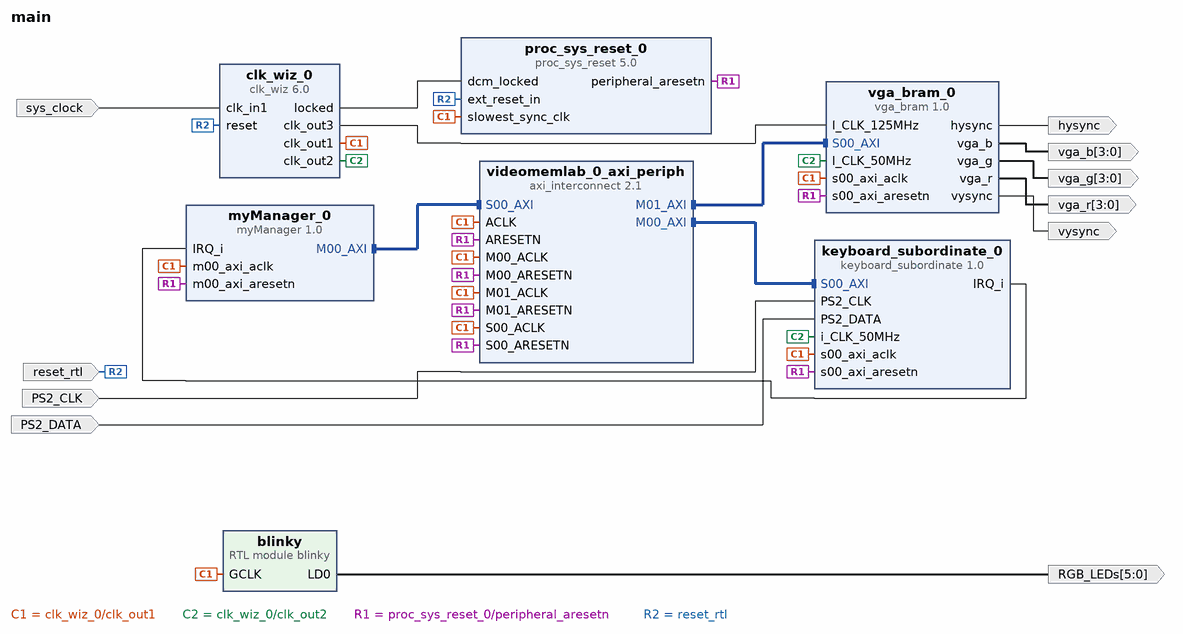
[diagram p0: block diagram of the top level]
# Vivado block design main, xc7z007sclg400-1, Vivado 2022.2
create_bd_design main

create_bd_port -dir I -type rst reset_rtl
set_property -dict {CONFIG.POLARITY ACTIVE_HIGH} [get_bd_ports reset_rtl]
create_bd_port -dir O -from 5 -to 0 RGB_LEDs
create_bd_port -dir I -type clk sys_clock
set_property -dict {CONFIG.FREQ_HZ 125000000 CONFIG.PHASE 0.0} [get_bd_ports sys_clock]
create_bd_port -dir I PS2_CLK
create_bd_port -dir I PS2_DATA
create_bd_port -dir O -from 3 -to 0 vga_b
create_bd_port -dir O -from 3 -to 0 vga_g
create_bd_port -dir O -from 3 -to 0 vga_r
create_bd_port -dir O vysync
create_bd_port -dir O hysync

create_bd_cell -type ip -vlnv xilinx.com:ip:proc_sys_reset:5.0 proc_sys_reset_0
create_bd_cell -type ip -vlnv xilinx.com:ip:clk_wiz:6.0 clk_wiz_0
set_property -dict [list \
  CONFIG.CLKOUT2_JITTER 143.688 \
  CONFIG.CLKOUT2_PHASE_ERROR 96.948 \
  CONFIG.CLKOUT2_REQUESTED_OUT_FREQ 50.000 \
  CONFIG.CLKOUT2_USED true \
  CONFIG.CLKOUT3_JITTER 119.348 \
  CONFIG.CLKOUT3_PHASE_ERROR 96.948 \
  CONFIG.CLKOUT3_REQUESTED_OUT_FREQ 125.000 \
  CONFIG.CLKOUT3_USED true \
  CONFIG.CLK_IN1_BOARD_INTERFACE sys_clock \
  CONFIG.MMCM_CLKOUT1_DIVIDE 20 \
  CONFIG.MMCM_CLKOUT2_DIVIDE 8 \
  CONFIG.NUM_OUT_CLKS 3 \
  CONFIG.USE_BOARD_FLOW true \
] [get_bd_cells clk_wiz_0]
create_bd_cell -type module -reference blinky blinky
set_property -dict {CONFIG.out_off_mask 0x00000021 CONFIG.out_on_mask 0x00000017 CONFIG.out_size 6} [get_bd_cells blinky]
create_bd_cell -type ip -vlnv Sola-Thomas:Project_6:keyboard_subordinate:1.0 keyboard_subordinate_0
create_bd_cell -type ip -vlnv solathomas.com:Project_6:vga_bram:1.0 vga_bram_0
create_bd_cell -type ip -vlnv xilinx.com:ip:axi_interconnect:2.1 videomemlab_0_axi_periph
set_property -dict {CONFIG.NUM_MI 2} [get_bd_cells videomemlab_0_axi_periph]
create_bd_cell -type ip -vlnv solathomas.com:Project_6:myManager:1.0 myManager_0

# ---- connections ----

connect_bd_intf_net [get_bd_intf_pins myManager_0/M00_AXI] [get_bd_intf_pins videomemlab_0_axi_periph/S00_AXI]
connect_bd_intf_net [get_bd_intf_pins videomemlab_0_axi_periph/M00_AXI] [get_bd_intf_pins keyboard_subordinate_0/S00_AXI]
connect_bd_intf_net [get_bd_intf_pins videomemlab_0_axi_periph/M01_AXI] [get_bd_intf_pins vga_bram_0/S00_AXI]
connect_bd_net [get_bd_ports PS2_CLK] [get_bd_pins keyboard_subordinate_0/PS2_CLK]
connect_bd_net [get_bd_ports PS2_DATA] [get_bd_pins keyboard_subordinate_0/PS2_DATA]
connect_bd_net -net blinky_0_LD0 [get_bd_pins blinky/LD0] [get_bd_ports RGB_LEDs]
connect_bd_net [get_bd_pins clk_wiz_0/clk_out1] \
  [get_bd_pins proc_sys_reset_0/slowest_sync_clk] [get_bd_pins blinky/GCLK] [get_bd_pins keyboard_subordinate_0/s00_axi_aclk] \
  [get_bd_pins vga_bram_0/s00_axi_aclk] [get_bd_pins videomemlab_0_axi_periph/ACLK] \
  [get_bd_pins videomemlab_0_axi_periph/S00_ACLK] [get_bd_pins videomemlab_0_axi_periph/M00_ACLK] \
  [get_bd_pins videomemlab_0_axi_periph/M01_ACLK] [get_bd_pins myManager_0/m00_axi_aclk]
connect_bd_net [get_bd_pins clk_wiz_0/clk_out2] [get_bd_pins keyboard_subordinate_0/i_CLK_50MHz] [get_bd_pins vga_bram_0/I_CLK_50MHz]
connect_bd_net [get_bd_pins clk_wiz_0/clk_out3] [get_bd_pins vga_bram_0/I_CLK_125MHz]
connect_bd_net [get_bd_pins clk_wiz_0/locked] [get_bd_pins proc_sys_reset_0/dcm_locked]
connect_bd_net [get_bd_pins keyboard_subordinate_0/IRQ_i] [get_bd_pins myManager_0/IRQ_i]
connect_bd_net [get_bd_pins proc_sys_reset_0/peripheral_aresetn] \
  [get_bd_pins keyboard_subordinate_0/s00_axi_aresetn] [get_bd_pins vga_bram_0/s00_axi_aresetn] \
  [get_bd_pins videomemlab_0_axi_periph/S00_ARESETN] [get_bd_pins videomemlab_0_axi_periph/M00_ARESETN] \
  [get_bd_pins videomemlab_0_axi_periph/ARESETN] [get_bd_pins videomemlab_0_axi_periph/M01_ARESETN] \
  [get_bd_pins myManager_0/m00_axi_aresetn]
connect_bd_net [get_bd_ports reset_rtl] [get_bd_pins proc_sys_reset_0/ext_reset_in] [get_bd_pins clk_wiz_0/reset]
connect_bd_net [get_bd_ports sys_clock] [get_bd_pins clk_wiz_0/clk_in1]
connect_bd_net [get_bd_pins vga_bram_0/hysync] [get_bd_ports hysync]
connect_bd_net [get_bd_pins vga_bram_0/vga_b] [get_bd_ports vga_b]
connect_bd_net [get_bd_pins vga_bram_0/vga_g] [get_bd_ports vga_g]
connect_bd_net [get_bd_pins vga_bram_0/vga_r] [get_bd_ports vga_r]
connect_bd_net [get_bd_pins vga_bram_0/vysync] [get_bd_ports vysync]

# ---- address map ----
assign_bd_address -offset 0x44A00000 -range 64K -target_address_space [get_bd_addr_spaces myManager_0/M00_AXI] [get_bd_addr_segs keyboard_subordinate_0/S00_AXI/S00_AXI_reg]
assign_bd_address -offset 0x44A10000 -range 64K -target_address_space [get_bd_addr_spaces myManager_0/M00_AXI] [get_bd_addr_segs vga_bram_0/S00_AXI/S00_AXI_reg]

validate_bd_design
save_bd_design
